# EAGLE design page1 (EAGLE 7.3.0)
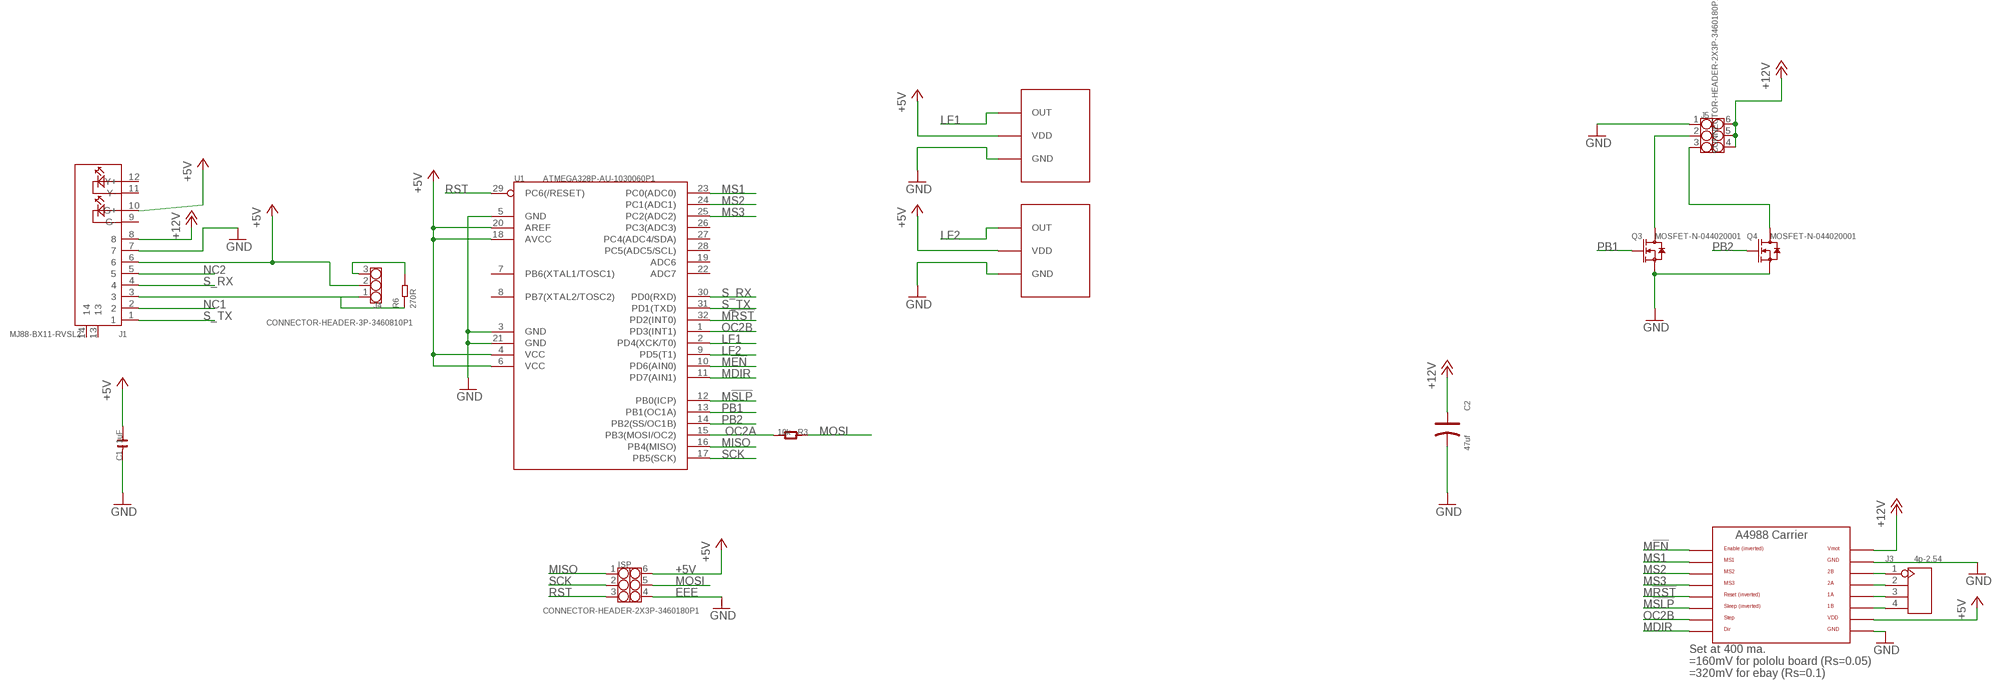
[diagram p0: schematic, sheet 1]

## Parts
C1  1uF  C-0805  [C0805]
C2  47uf  TANTALUM-SMD-47UF-16V(AVX-C)  [AVX-C]
ISP  CONNECTOR-HEADER-2X3P-3460180P1  [2X3P-2.54-2.54-11.6-3.0-BLACK-MALE]
J1  MJ88-BX11-RVSL2  RJ45-MJ88-BX11-RVSL2  [RJ45-12+2P-16.3X15.4X11.5MM-IN]
J3  4p-2.54  DIP-BLACK-MALE-HEADER-VERT(4P-2.54)  [H4-2.54]
J4  CONNECTOR-HEADER-3P-3460810P1  [1X3P-2.54-2.54-11.6-3.0-BLACK-MALE]
J5  CONNECTOR-HEADER-2X3P-3460180P1  [2X3P-2.54-2.54-11.6-3.0-BLACK-MALE]
Q3  MOSFET-N-044020001  [SOT23]
Q4  MOSFET-N-044020001  [SOT23]
R3  10k  R-0603  [R0603]
R6  270R  SMD-RES-270R-5%-1/8W(0805)  [R0805]
U1  ATMEGA328P-AU-1030060P1  [TQFP32]
U$1  A4988BREAKOUT  [A4988BREAKOUT]
U$5  TSL235  [TSL235R-2MM-S]
U$6  TSL235  [TSL235R-2MM-S]

## Nets
+5V [pwr12]: C1.2 ISP.6 J1.6 J1.10(G+) J4.2 U1.4(VCC) U1.6(VCC) U1.18(AVCC) U1.20(AREF) U$1.VDD U$5.P$2(VDD) U$6.P$2(VDD)
+12V [pwr12]: C2.+ J1.8 J5.4 J5.5 J5.6 U$1.VMOT
EEE: C1.1 C2.- ISP.4 J1.7 J5.1 Q3.2(S) Q4.2(S) U1.3(GND) U1.5(GND) U1.21(GND) U$1.GND U$1.GND@0(GND) U$5.P$1(GND) U$6.P$1(GND) ; supply symbol labelled GND
LF1: U1.2(PD4(XCK/T0)) U$5.P$3(OUT)
LF2: U1.9(PD5(T1)) U$6.P$3(OUT)
M!EN: U1.10(PD6(AIN0)) U$1.EN
M!RST: U1.32(PD2(INT0)) U$1.RST
M!SLP: U1.12(PB0(ICP)) U$1.SLP(SLEEP)
MDIR: U1.11(PD7(AIN1)) U$1.DIR
MISO: ISP.1 U1.16(PB4(MISO))
MOSI: ISP.5 R3.1
MS1: U1.23(PC0(ADC0)) U$1.MS1
MS2: U1.24(PC1(ADC1)) U$1.MS2
MS3: U1.25(PC2(ADC2)) U$1.MS3
N$1: J1.3 J4.1 R6.1
N$3: J5.3 Q4.3(D)
N$4: J5.2 Q3.3(D)
N$11: J4.3 R6.2
N$13: J3.1 U$1.2B
N$14: J3.2 U$1.2A
N$15: J3.3 U$1.1A
N$16: J3.4 U$1.1B
NC1: J1.2
NC2: J1.5
OC2A: R3.2 U1.15(PB3(MOSI/OC2))
OC2B: U1.1(PD3(INT1)) U$1.STEP
PB1: Q3.1(G) U1.13(PB1(OC1A))
PB2: Q4.1(G) U1.14(PB2(SS/OC1B))
RST: ISP.3 U1.29(PC6(/RESET))
S_RX: J1.4 U1.30(PD0(RXD))
S_TX: J1.1 U1.31(PD1(TXD))
SCK: ISP.2 U1.17(PB5(SCK))
Unconnected: J1.9(G-) J1.11(Y-) J1.12(Y+) J1.13 J1.14 U1.7(PB6(XTAL1/TOSC1)) U1.8(PB7(XTAL2/TOSC2)) U1.19(ADC6) U1.22(ADC7) U1.26(PC3(ADC3)) U1.27(PC4(ADC4/SDA)) U1.28(PC5(ADC5/SCL))

## Notes on the sheet
- Set at 400 ma.
  =160mV for pololu board (Rs=0.05)
  =320mV for ebay (Rs=0.1)

## Library data of the parts
C1 = OPL Eagle Library:C*
C2 = Seeed-Capacitor-2016:TANTALUM-SMD-47UF-16V(AVX-C): 302020022; MPN: TAJC476*016#NJ
ISP J5 = OPL Eagle Library:CONNECTOR-HEADER-2X3P
J1 = Seeed-OPL-Connector:RJ45-MJ88-BX11-RVSL2: 320140004; MPN: MJ88-BX11-RVSL2
J3 = Seeed-Connector -2016:DIP-BLACK-MALE-HEADER-VERT(4P-2.54): 320020017; MPN: P125-1104A0BS116A1
J4 = OPL Eagle Library:CONNECTOR-HEADER-3P
Q3 Q4 = OPL Eagle Library:MOSFET-N: CJ2302：SMD MOSFET N-CH 20V-2.1A
R3 = OPL Eagle Library:R*
R6 = Seeed-OPL-Resistor:SMD-RES-270R-5%-1/8W(0805): 301010360; MPN: RC0805JR-07270RL
U1 = OPL Eagle Library:ATMEGA328P-AU: 8-bit AVR Microcontroller with 32K Bytes In-System Programmable Flash
U$1 = RepRapjr:A4988BREAKOUT
U$5 U$6 = Chris_parts:TSL235

## Net classes
0 default: width 0.254 mm, clearance 0.254 mm
1 pwr12: width 0.305 mm, drill 0.61 mm, clearance 0.254 mm

## Board
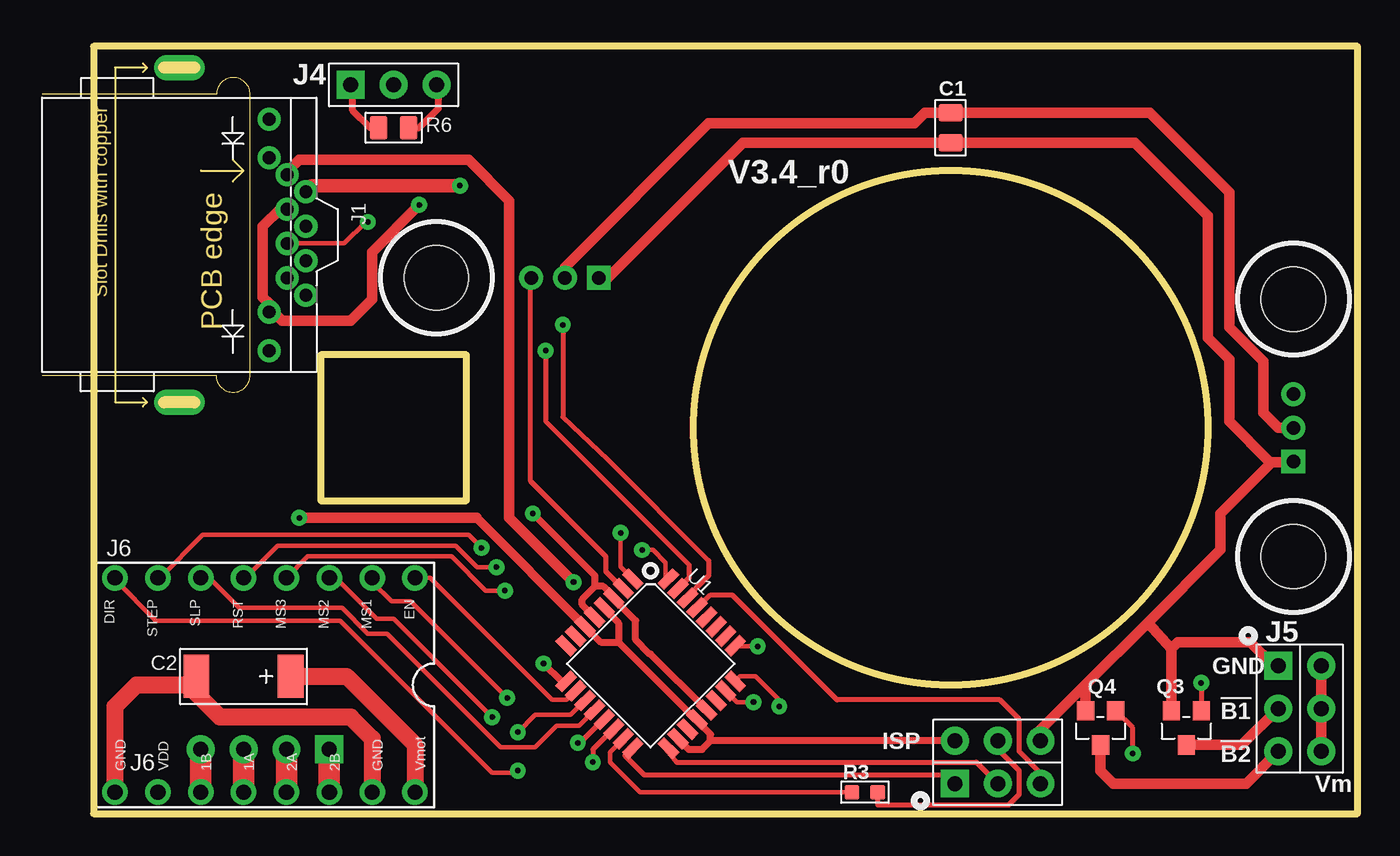
[diagram p1: board, top side]
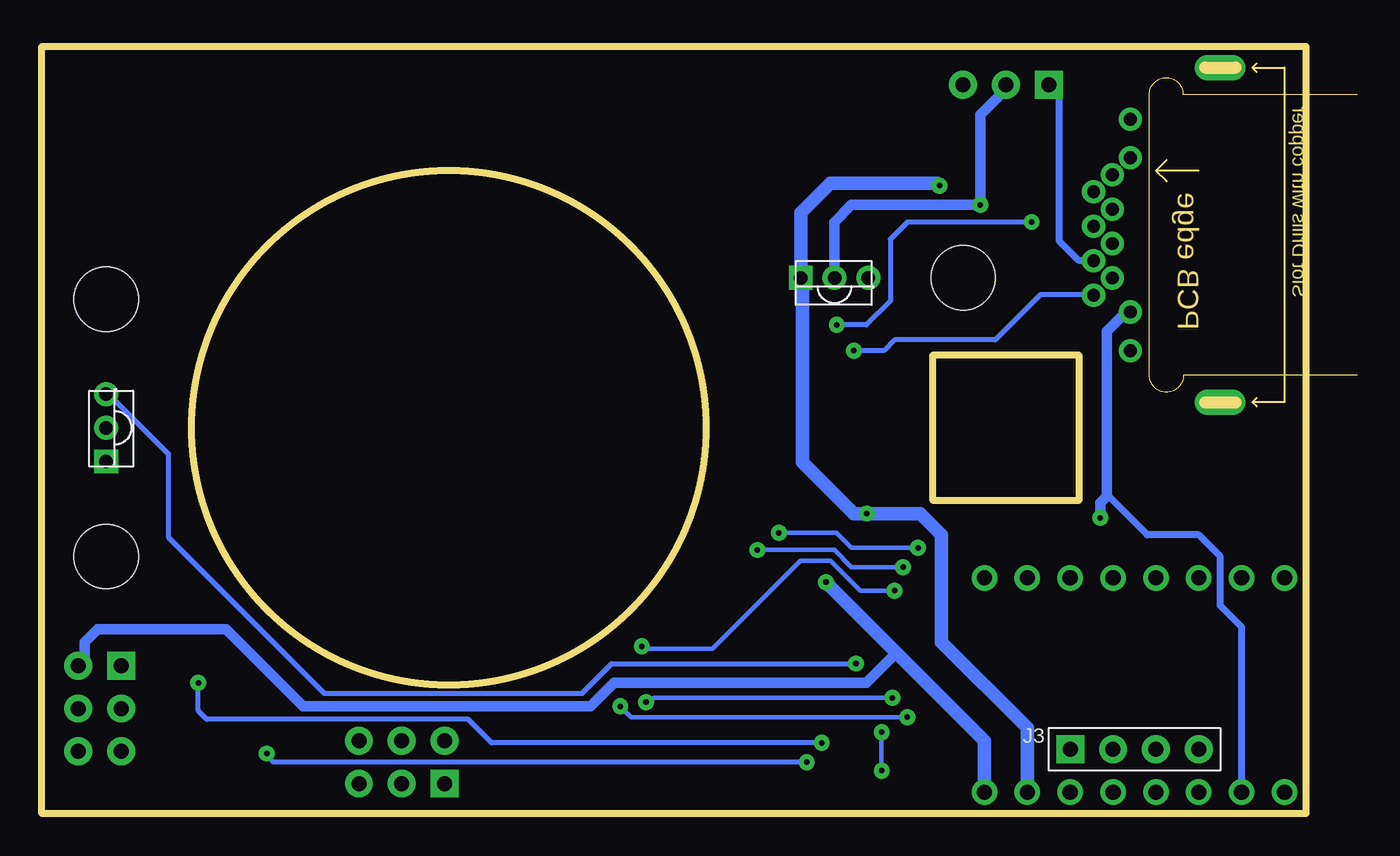
[diagram p2: board, bottom side, seen from below]

Size 74.91 x 45.39 mm. Coordinates in mm from the lower left corner, seen from the top.
Outline: 0,0 74.91,0 74.91,45.39 0,45.39 0,0
Copper layers (1*2*15*16): Top 0.035mm / dielectric 0.2mm / Route2 0.0175mm / dielectric 1.1mm / Route15 0.0175mm / dielectric 0.2mm / Bottom 0.035mm
Design rules "SeeedStudio_DRU_no_angle_20130527 *": minimum track width 6mil, minimum drill 12mil, track to track 6mil, track to pad 6mil, pad to pad 6mil, via to via 6mil, smd to smd 0mil, copper to edge 10mil, drill to drill 10mil, minimum pad ring 12mil, minimum via ring 12mil, stop-mask expansion 2mil, vias tented up to drill 25mil, thermal gap 10mil
Holes 3.8 mm at 20.32,31.75 71.12,30.48 71.12,15.24
Milling: area 35.6,7.6 to 66,38.1; 8 lines

### Footprints (pad centres in the part's own frame; a part is rotated, then mirrored left to right if it is on the bottom)
C0805 = smd 1.016 x 1.397: 1 -0.889,0; 2 0.889,0
AVX-C = smd 1.524 x 2.54: + -2.794,0; - 2.794,0
2X3P-2.54-2.54-11.6-3.0-BLACK-MALE = drill 0.889 pad 1.651 square: 1 -1.27,2.54 | drill 0.889 pad 1.651: 2 -1.27,0; 3 -1.27,-2.54; 4 1.27,-2.54; 5 1.27,0; 6 1.27,2.54
RJ45-12+2P-16.3X15.4X11.5MM-IN = drill 0.762 pad 1.27: 1 3.57,7.5; 2 2.55,6.4; 3 1.53,7.5; 4 0.51,6.4; 5 -0.51,7.5; 6 -1.53,6.4; 7 -2.55,7.5; 8 -3.57,6.4; 9 6.86,5.32; 10 4.57,5.32; 11 -4.57,5.32; 12 -6.86,5.32 | drill 0.6 pad 1.5 long: 13 -9.92,0; 14 9.92,0
H4-2.54 = drill 0.889 pad 1.651 square: 1 0,3.81 | drill 0.889 pad 1.651: 2 0,1.27; 3 0,-1.27; 4 0,-3.81
1X3P-2.54-2.54-11.6-3.0-BLACK-MALE = drill 0.889 pad 1.651 square: 1 0,2.54 | drill 0.889 pad 1.651: 2 0,0; 3 0,-2.54
SOT23 = smd 1.016 x 1.143: 1 -0.889,-1.016; 2 0.889,-1.016; 3 0,1.016
R0603 = smd 0.889 x 0.889: 1 -0.762,0; 2 0.762,0
R0805 = smd 1.397 x 1.016: 1 0,0.889; 2 0,-0.889
TQFP32 = smd 1.27 x 0.559: 1 -4.293,2.8; 2 -4.293,2; 3 -4.293,1.2; 4 -4.293,0.4; 5 -4.293,-0.4; 6 -4.293,-1.2; 7 -4.293,-2; 8 -4.293,-2.8; 17 4.293,-2.8; 18 4.293,-2; 19 4.293,-1.2; 20 4.293,-0.4; 21 4.293,0.4; 22 4.293,1.2; 23 4.293,2; 24 4.293,2.8 | smd 0.559 x 1.27: 9 -2.8,-4.293; 10 -2,-4.293; 11 -1.2,-4.293; 12 -0.4,-4.293; 13 0.4,-4.293; 14 1.2,-4.293; 15 2,-4.293; 16 2.8,-4.293; 25 2.8,4.293; 26 2,4.293; 27 1.2,4.293; 28 0.4,4.293; 29 -0.4,4.293; 30 -1.2,4.293; 31 -2,4.293; 32 -2.8,4.293
A4988BREAKOUT = drill 0.9: 1A 8.89,1.27; 1B 11.43,1.27; 2A 6.35,1.27; 2B 3.81,1.27; DIR 16.51,-11.43; EN -1.27,-11.43; GND 16.51,1.27; GND@0 1.27,1.27; MS1 1.27,-11.43; MS2 3.81,-11.43; MS3 6.35,-11.43; RST 8.89,-11.43; SLP 11.43,-11.43; STEP 13.97,-11.43; VDD 13.97,1.27; VMOT -1.27,1.27
TSL235R-2MM-S = drill 0.8 square: P$1 -2,0 | drill 0.8 pad 1.422: P$2 0,0; P$3 2,0

### Placement (x,y rotation side)
C1  50.8,40.64 90 top
C2  8.89,8.13 180 top
ISP  53.59,3.05 90 top
J1  5.08,34.29 270 top
J3  10.16,3.81 90 bottom
J4  17.78,43.18 90 top
J5  71.5,6.22 0 top
Q3  64.77,5.08 180 top
Q4  59.69,5.08 180 top
R3  45.72,1.27 180 top
R6  17.78,40.64 90 top
U1  33.02,8.89 315 top
U$1  17.78,2.54 180 top
U$5  27.94,31.75 0 bottom
U$6  71.12,22.86 90 bottom

### Tracks (layer width: path | path; a pad name or v marks a point on that pad's centre or on a via)
+5V  (via drill 0.33)
  Top 0.305: J1.6 | 10.67,29.72 J1.10
  Top 0.406: U1.6 30.05,10.16 31.11,10.16 | U1.18 35.27,3.81 36.07,3.81 36.58,4.32 | 36.58,4.32 36.58,4.7 35.77,5.5 U1.20 35.7,5.57 31.11,10.16 | U1.4 30.21,12.21 31.11,11.3 31.11,10.16 | ISP.6 36.58,4.32
  Top 0.508: 22.69,17.53 U1.6
  Top 0.61: J1.6 11.05,35.81 10.03,34.8 10.03,30.61 10.4,30.24 J1.10 | U$6.P$2 70.23,22.86 69.34,23.75 69.34,26.8 67.31,28.83 67.31,36.83 62.61,41.53 C1.2 49.28,41.53 48.64,40.89 36.45,40.89 27.94,32.38 U$5.P$2 | 10.67,29.72 11.18,29.21 15.24,29.21 16.51,30.48 16.51,33.27 v19.3,36.07 | 22.69,17.53 v12.19,17.53
  Bottom 0.406: U$1.VDD 3.81,11.05 5.08,12.32 5.08,15.24 6.35,16.51 9.4,16.51 11.68,18.8 11.81,18.8 11.81,19.05
  Bottom 0.61: U$5.P$2 27.94,35.05 26.92,36.07 v19.3,36.07 19.3,41.4 18.03,42.67 J4.2 | J1.10 10.67,29.72 11.81,28.57 11.81,19.05 11.81,18.92 | v12.19,17.53 12.19,18.41 11.81,18.8
+12V  (via drill 0.33 pad 0.25)
  Top 0.61: J5.6 J5.5 J5.4 | J1.8 11.57,37.86 11.57,38.11 12.19,38.73 22.23,38.73 24.64,36.32 24.64,17.53 v28.45,13.72
  Top 1.016: C2.+ 14.99,8.13 19.05,4.06 U$1.VMOT
  Bottom 0.61: J5.6 72.39,9.14 72.39,10.16 71.63,10.92 64.01,10.92 59.44,6.35 42.42,6.35 41.02,7.75 26.04,7.75 24.26,9.53
  Bottom 0.813: U$1.VMOT 19.05,4.32 24.26,9.53 v28.45,13.72
EEE  (via drill 0.33)
  Top 0.305: U1.21 36.41,6.14
  Top 0.406: 29.63,11.64 U1.5 28.96,12.39 28.96,12.7 29.72,13.46 | U1.21 33.02,9.46 32.96,9.46 32.13,10.29 32.13,11.43 30.83,12.73 U1.3 | U1.3 30.91,12.77 | U1.3 30.83,12.86 30.23,13.46 29.72,13.46 | 29.72,13.46 29.72,14.1 v26.04,17.78
  Top 0.61: U$6.P$1 71.09,20.83 69.85,20.83 | 69.85,20.83 69.72,20.83 67.31,23.24 67.31,26.92 66.04,28.19 66.04,35.43 61.72,39.75 C1.1 38.48,39.75 30.48,31.75 U$5.P$1 | ISP.4 56.13,4.95 58.8,7.62 | 58.8,7.62 62.48,11.3 | 62.48,11.3 66.8,15.62 66.8,17.78 69.85,20.83 | Q3.2 63.88,9.78 | 63.88,9.78 62.48,11.3 | Q4.2 58.8,7.62 | J5.1 69.98,8.76 68.58,10.16 64.26,10.16 63.88,9.78
  Top 0.813: v21.72,37.21 12.95,37.21 J1.7
  Top 1.016: U$1.GND 1.27,6.35 2.54,7.62 5.59,7.62 | 5.59,7.62 C2.- | 5.59,7.62 7.49,5.71 15.24,5.71 16.51,4.45 U$1.GND@0
  Bottom 0.813: U$1.GND@0 16.51,5.08 21.59,10.16 21.59,16.51 22.86,17.78 v26.04,17.78 26.8,17.78 29.84,20.83 29.84,31.66 U$5.P$1 29.94,35.59 28.19,37.34 21.84,37.34 v21.72,37.21
LF1
  Top 0.305: U$5.P$3 25.91,31.34 25.91,19.68 30.35,15.24 30.35,14.35 31.36,13.34 U1.2
LF2  (via drill 0.33)
  Top 0.406: U1.9 27.73,7.83 v26.67,8.89
  Bottom 0.305: U$6.P$3 70.96,24.86 67.44,21.34 67.44,16.38 58.17,7.11 42.93,7.11 41.15,8.89 v26.67,8.89
M!EN
  Top 0.254: U$1.EN 19.94,13.97 27.18,6.73 28.03,6.73 U1.10
  Top 0.305: U1.10 28.57,7.23
M!RST  (via drill 0.33)
  Top 0.254: U$1.RST 9.02,13.97 10.92,15.88 21.46,15.88 22.73,14.61 v23.88,14.61 | v32.51,15.62 33.15,15.62 33.91,14.86 33.91,14.07 U1.32
  Bottom 0.254: v23.88,14.61 26.92,14.61 27.94,15.62 v32.51,15.62
M!SLP
  Top 0.254: U$1.SLP 6.86,13.97 8.64,12.19 14.73,12.19 16.26,10.67 17.4,10.67 24.13,3.94 26.16,3.94 27.43,5.21 28.77,5.21 U1.12
MDIR  (via drill 0.33)
  Top 0.254: U$1.DIR 1.27,13.84 3.68,11.43 14.61,11.43 23.62,2.41 24.89,2.41 v25.15,2.54 | v25.15,4.83 26.16,5.84 28.27,5.84 U1.11
  Bottom 0.254: v25.15,2.54 v25.15,4.83
MISO
  Top 0.305: U1.16 31.94,3.88 31.5,3.43 32.64,2.29 50.67,2.29
  Top 0.406: 50.67,2.29 ISP.1
MOSI
  Top 0.305: R3.1 46.48,0.51 54.23,0.51 54.86,1.14 54.86,2.54 53.72,3.68 53.72,4.32 ISP.5
MS1  (via drill 0.33)
  Top 0.254: U$1.MS1 16.51,13.72 17.65,12.57 18.8,12.57 v24.51,6.86 | v39.12,6.6 38.13,6.6 U1.23
  Bottom 0.254: v24.51,6.86 38.61,6.86 v39.12,6.6
MS2  (via drill 0.33)
  Top 0.254: U$1.MS2 14.35,13.97 16.76,11.56 17.78,11.56 v23.62,5.71 | v40.64,6.35 40.64,6.73 39.24,8.13 38.33,8.13 U1.24
  Bottom 0.254: v23.62,5.71 40.01,5.71 v40.64,6.35
MS3  (via drill 0.33)
  Top 0.254: U$1.MS3 12.7,15.24 21.21,15.24 23.24,13.21 v24.38,13.21 | v39.37,9.91 38.08,9.91 U1.25
  Bottom 0.254: v24.38,13.21 26.42,13.21 28.19,14.99 29.97,14.99 35.18,9.78 39.24,9.78 v39.37,9.91
N$1
  Top 0.406: R6.1 16.38,40.64 15.37,41.66 15.37,43.05 J4.1
  Bottom 0.406: J1.3 13.46,32.76 14.61,33.91 14.61,42.55 J4.1
N$3
  Top 0.61: J5.3 68.33,1.78 60.45,1.78 59.69,2.54 Q4.3
N$4
  Top 0.61: Q3.3 68.07,4.06 J5.2
N$11
  Top 0.406: R6.2 19.3,40.64 20.45,41.78 20.45,43.05 J4.3
N$13
  Top 1.27: J3.1 U$1.2B
N$14
  Top 1.27: J3.2 U$1.2A
N$15
  Top 1.27: J3.3 U$1.1A
N$16
  Top 1.27: J3.4 U$1.1B
OC2A
  Top 0.254: R3.2 32.38,1.27 30.61,3.05 30.61,3.65 U1.15
OC2B  (via drill 0.33)
  Top 0.254: U$1.STEP 3.94,13.97 6.48,16.51 22.23,16.51 v22.99,15.75 | v31.24,16.64 31.24,14.63 U1.1
  Bottom 0.254: v22.99,15.75 26.92,15.75 27.81,16.64 v31.24,16.64
PB1  (via drill 0.33)
  Top 0.305: U1.13 30.14,5.5 28.83,4.19 v28.7,4.19 | v65.66,7.75 Q3.1
  Bottom 0.305: v28.7,4.19 48.26,4.19 49.66,5.59 65.15,5.59 Q3.1 v65.66,7.75
PB2  (via drill 0.33)
  Top 0.305: U1.14 30.79,5.01 29.59,3.81 v29.59,3.05 | v61.59,3.56 61.59,5.08 Q4.1
  Bottom 0.305: v29.59,3.05 61.21,3.05 v61.59,3.56
RST
  Top 0.305: U1.29 35.83,12.21 36.58,12.95 37.85,12.95 44.07,6.73 53.72,6.73 54.86,5.59 54.86,3.68 56.13,2.41 ISP.3
S_RX  (via drill 0.33)
  Top 0.254: J1.4 14.86,33.78 16.13,35.05 v16.26,35.05 | 36.45,14.99 30.48,20.95 27.81,23.5
  Top 0.305: v27.81,28.96 27.81,23.5 | U1.30 35.21,12.86 36.45,14.1 36.45,14.99
  Bottom 0.305: v27.81,28.96 26.04,28.96 24.64,30.35 24.64,34.04 23.62,35.05 v16.26,35.05
S_TX  (via drill 0.33)
  Top 0.254: 35.31,14.73 26.8,23.24 26.8,23.37
  Top 0.305: v26.8,27.43 26.8,23.37 | U1.31 34.68,13.34 35.31,13.97 35.31,14.73
  Bottom 0.305: J1.1 12.59,30.73 15.75,30.73 18.41,28.07 24.38,28.07 25.02,27.43 v26.8,27.43
SCK
  Top 0.305: U1.17 34.08,3.64 34.54,3.05 52.32,3.05 ISP.2

### Text on the board
tPlace: V3.4_r0
tNames: J6 | GND | !B1 | J6 | !B2 | Vm